# EAGLE design [COMPLETE] ArduinoShield_8x8DM (EAGLE 7.2.0)
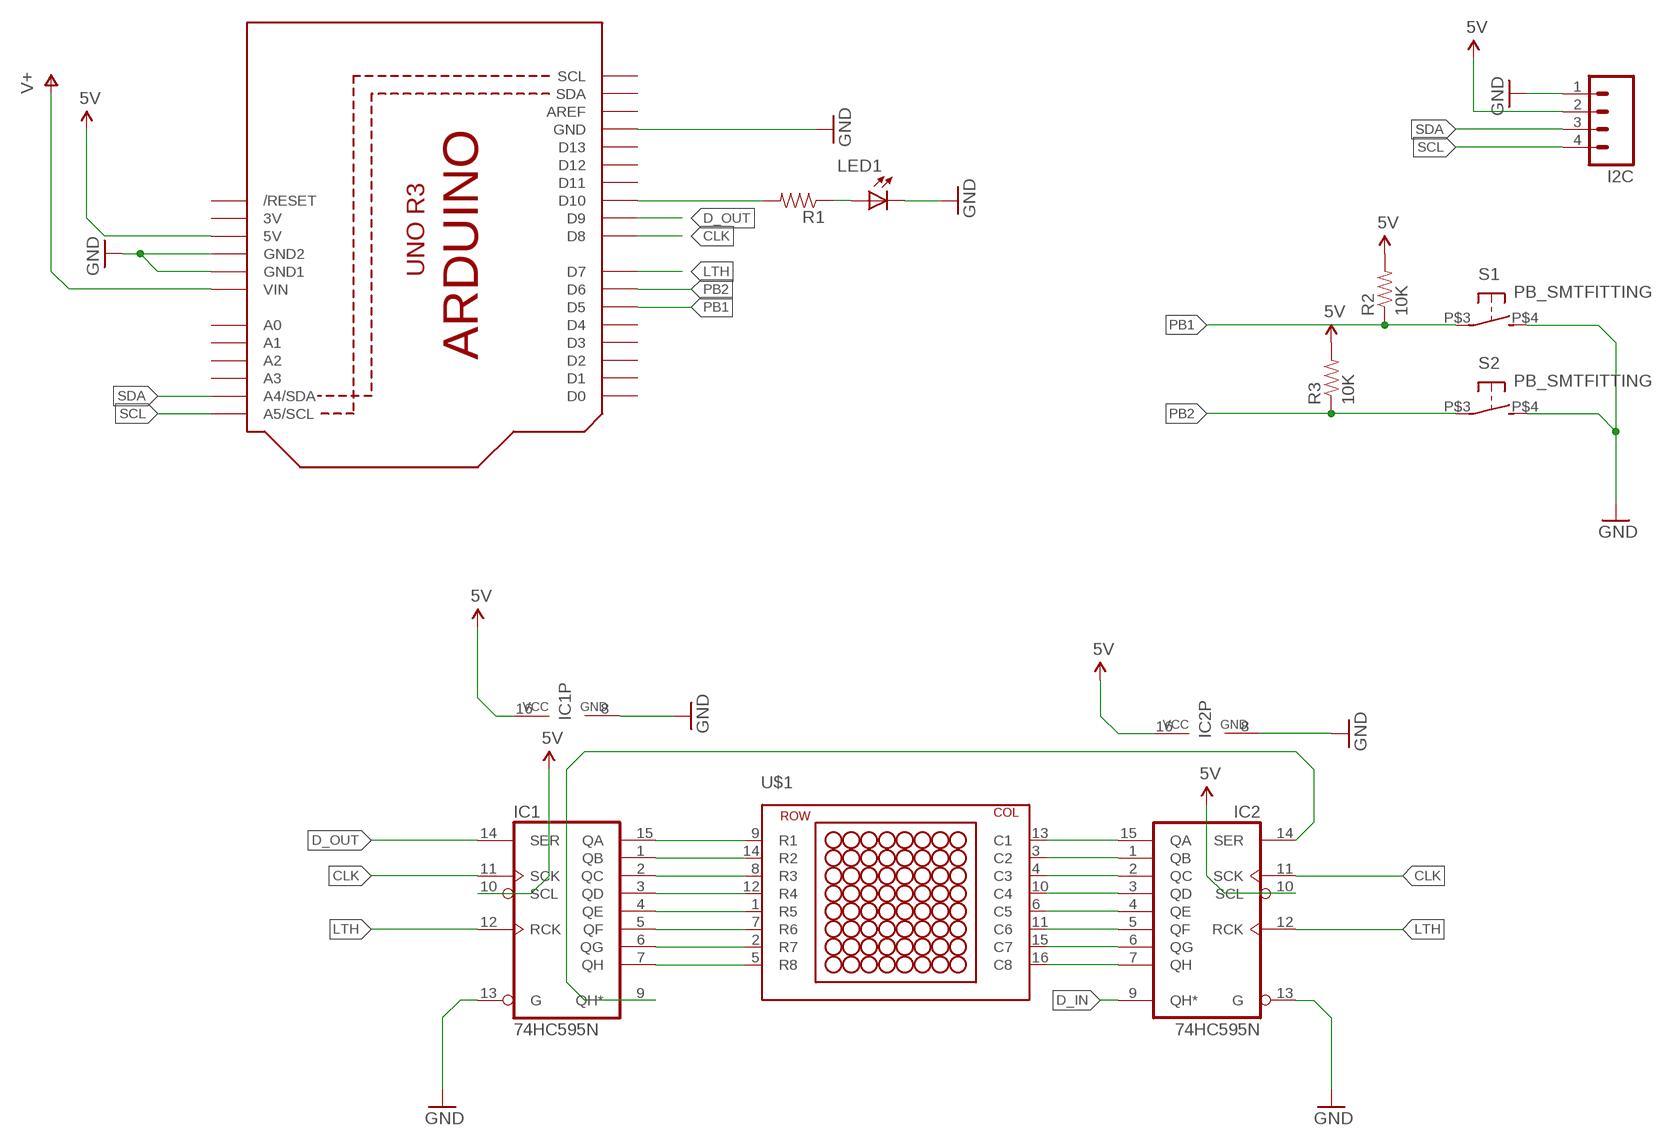
[diagram p0: schematic, sheet 1]

## Parts
I2C  M04PTH  [1X04]
IC1  74HC595N  [DIL16]
IC2  74HC595N  [DIL16]
LED1  LED/0805  [CHIP-LED0805]
R1  RESISTOR0805-RES  [0805]
R2  10K  RESISTOR0805-RES  [0805]
R3  10K  RESISTOR0805-RES  [0805]
S1  PB_SMTFITTING  [PB_SMT_TIGHT]
S2  PB_SMTFITTING  [PB_SMT_TIGHT]
U1  ARDUINOR3-NOIOREF-NOTEXT  [ARDUINOR3-NOTEXT-NOIOREF]
U$1  8X8DM_2088AS  [8X8DM_2088AS]

## Nets
5V: I2C.2 IC1.10(SCL) IC1.16(VCC) IC2.10(SCL) IC2.16(VCC) R2.2 R3.2 U1.5V
CLK: IC1.11(SCK) IC2.11(SCK) U1.D8
D_IN: IC2.9(QH*)
D_OUT: IC1.14(SER) U1.D9
GND: I2C.1 IC1.8(GND) IC1.13(G) IC2.8(GND) IC2.13(G) LED1.C S1.P$4 S2.P$4 U1.GND U1.GND1 U1.GND2
LTH: IC1.12(RCK) IC2.12(RCK) U1.D7
N$1: IC1.1(QB) U$1.14(R2)
N$5: IC1.2(QC) U$1.8(R3)
N$6: IC1.3(QD) U$1.12(R4)
N$7: IC1.4(QE) U$1.1(R5)
N$8: IC1.5(QF) U$1.7(R6)
N$9: IC1.6(QG) U$1.2(R7)
N$10: IC1.7(QH) U$1.5(R8)
N$11: IC1.15(QA) U$1.9(R1)
N$12: IC2.1(QB) U$1.3(C2)
N$13: IC2.2(QC) U$1.4(C3)
N$14: IC2.3(QD) U$1.10(C4)
N$15: IC2.4(QE) U$1.6(C5)
N$16: IC2.5(QF) U$1.11(C6)
N$17: IC2.6(QG) U$1.15(C7)
N$18: IC2.7(QH) U$1.16(C8)
N$19: IC2.15(QA) U$1.13(C1)
N$20: IC1.9(QH*) IC2.14(SER)
N$26: R1.2 U1.D10
N$30: LED1.A R1.1
PB1: R2.1 S1.P$3 U1.D5
PB2: R3.1 S2.P$3 U1.D6
SCL: I2C.4 U1.A5(A5/SCL)
SDA: I2C.3 U1.A4(A4/SDA)
V+: U1.VIN
Unconnected: U1.A0 U1.A1 U1.A2 U1.A3 U1.AREF U1.D0 U1.D1 U1.D2 U1.D3 U1.D4 U1.D11 U1.D12 U1.D13 U1.RESET(/RESET) U1.SCL U1.SDA

## Power pins joined to a net without a drawn wire
3V: U1.3V

## Library data of the parts
I2C = AISCube_BYOG:M04: Header 4 Standard 4-pin 0.1" header. Use with straight break away headers (SKU : PRT-00116), right angle break away headers (PRT-00553), swiss pins (PRT-00743), machine pins (PRT-00117), and female headers (PRT-00115). Molex polarized connector foot print use with SKU : PRT-08231 with associated crimp pins and housings. 1MM SMD Version SKU: PRT-10208
IC1 IC2 = 74xx-eu:74*595: 8-bit SHIFT REGISTER, output latch
LED1 = AISCube_BYOG:LED: LED
R1-R3 = AISCube_BYOG:RESISTOR: Resistor Basic schematic elements and footprints for 0603, 1206, and PTH resistors.
S1 S2 = AISCube:PB_SMT: Low profile SMT pushbutton Used as reset & user buttons
U1 = adafruit:ARDUINOR3-NOIOREF
U$1 = AISCube_BYOG:8X8DM_2088AS

## Board
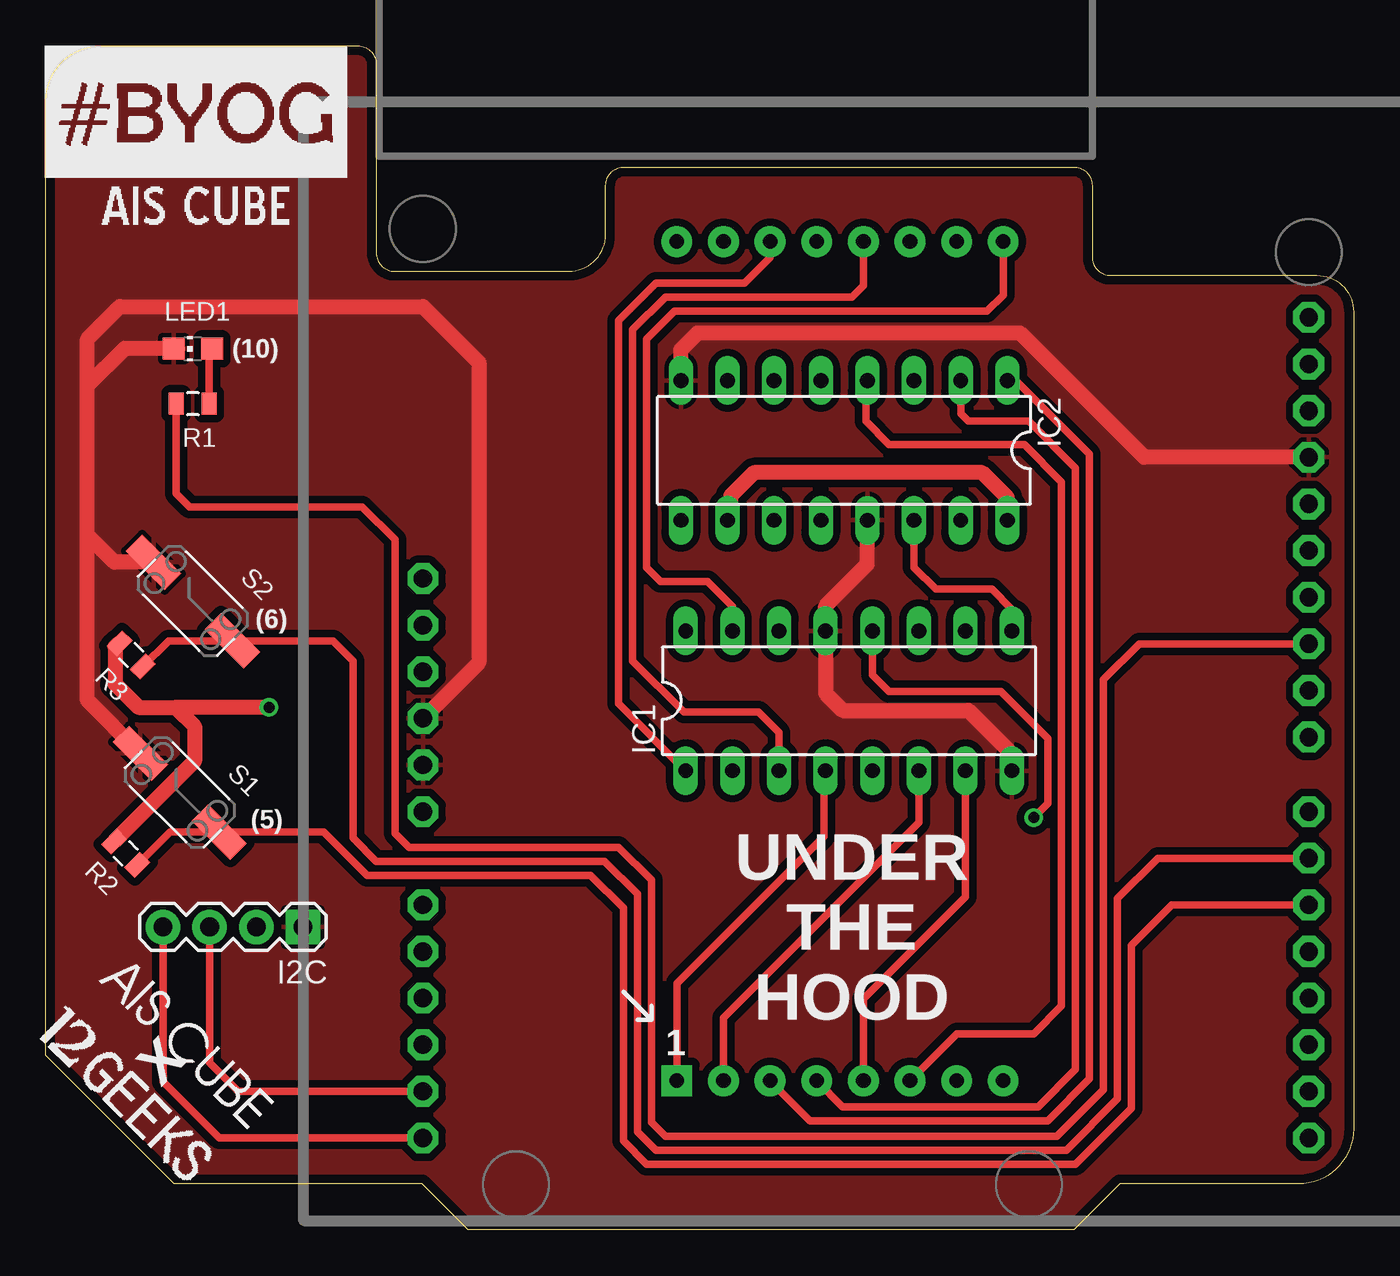
[diagram p1: board, top side]
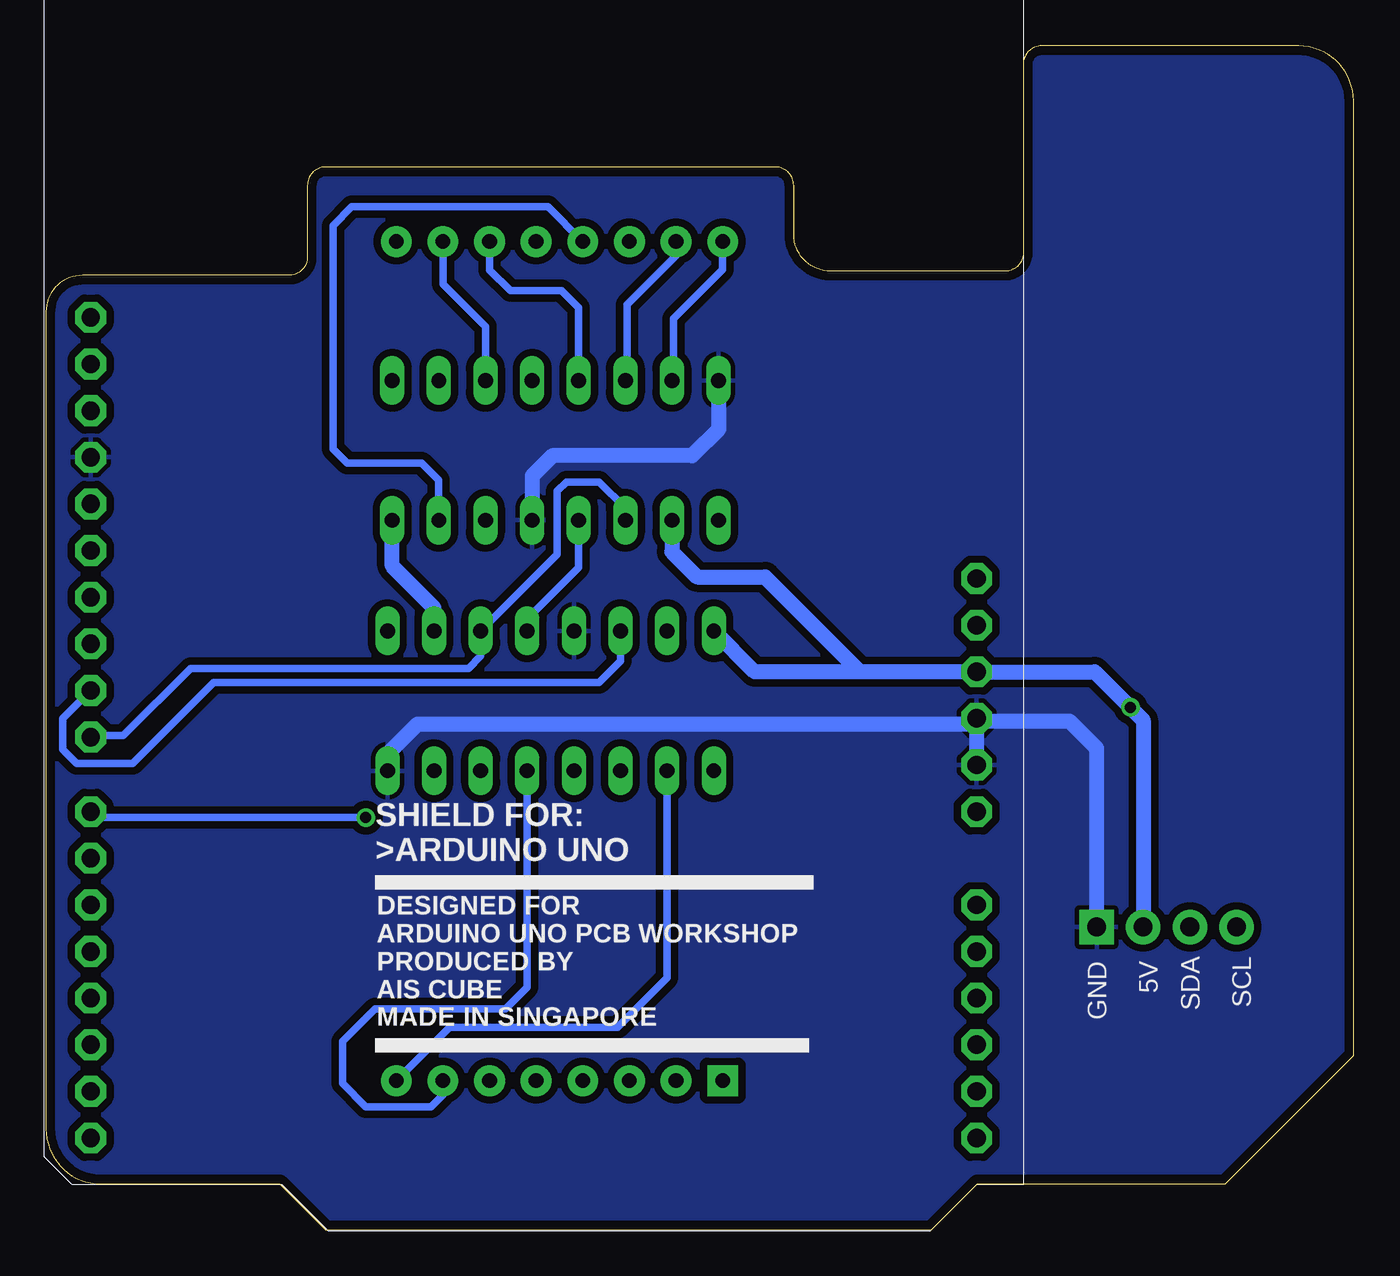
[diagram p2: board, bottom side, seen from below]

Size 71.25 x 64.5 mm. Coordinates in mm from the lower left corner, seen from the top.
Outline: 0,9.5 0,61.5 arc-90 3,64.5 17,64.5 arc-90 18,63.5 18,53.22 arc90 19,52.22 28.5,52.22 arc90 30.5,54.22 30.5,56.9 arc-90 31.5,57.9 56,57.9 arc-90 57,56.9 57,53 arc90 58,52 69.25,52 arc-90 71.25,50 71.25,5.5 arc-90 68.25,2.5 58.5,2.5 56,0 23,0 20.5,2.5 7,2.5 0,9.5
Copper layers (1*16): Top 0.0356mm / dielectric 1.5011mm / Bottom 0.0356mm
Design rules "AISCube": minimum track width 7mil, minimum drill 14mil, track to track 7mil, track to pad 7mil, pad to pad 7mil, via to via 7mil, smd to smd 0mil, copper to edge 20mil, drill to drill 8mil, minimum pad ring 10mil, minimum via ring 8mil, stop-mask expansion 4mil, vias tented up to drill 32mil, thermal gap 10mil

### Footprints (pad centres in the part's own frame; a part is rotated, then mirrored left to right if it is on the bottom)
1X04 = drill 1.016 pad 1.88 square: 1 0,0 | drill 1.016 pad 1.88: 2 2.54,0; 3 5.08,0; 4 7.62,0
DIL16 = drill 0.813 long: 1 -8.89,-3.81; 2 -6.35,-3.81; 3 -3.81,-3.81; 4 -1.27,-3.81; 5 1.27,-3.81; 6 3.81,-3.81; 7 6.35,-3.81; 8 8.89,-3.81; 9 8.89,3.81; 10 6.35,3.81; 11 3.81,3.81; 12 1.27,3.81; 13 -1.27,3.81; 14 -3.81,3.81; 15 -6.35,3.81; 16 -8.89,3.81
CHIP-LED0805 = smd 1.2 x 1.2: A 0,-1.05; C 0,1.05
0805 = smd 0.8 x 1.2: 1 -0.9,0; 2 0.9,0
PB_SMT_TIGHT = smd 3 x 1.27: P$3 -3.056,0.008; P$4 3.01,0.008
ARDUINOR3-NOTEXT-NOIOREF = drill 1 pad 1.676 octagon: 3V 35.56,2.54; 5V 38.1,2.54; A0 50.8,2.54; A1 53.34,2.54; A2 55.88,2.54; A3 58.42,2.54; A4 60.96,2.54; A5 63.5,2.54; AREF 23.876,50.8; D0 63.5,50.8; D1 60.96,50.8; D2 58.42,50.8; D3 55.88,50.8; D4 53.34,50.8; D5 50.8,50.8; D6 48.26,50.8; D7 45.72,50.8; D8 41.656,50.8; D9 39.116,50.8; D10 36.576,50.8; D11 34.036,50.8; D12 31.496,50.8; D13 28.956,50.8; GND 26.416,50.8; GND1 43.18,2.54; GND2 40.64,2.54; RESET 33.02,2.54; SCL 18.796,50.8; SDA 21.336,50.8; VIN 45.72,2.54
8X8DM_2088AS = drill 0.8 pad 1.676 square: 1 -8.89,0 | drill 0.8 pad 1.676: 2 -6.35,0; 3 -3.81,0; 4 -1.27,0; 5 1.27,0; 6 3.81,0; 7 6.35,0; 8 8.89,0; 9 8.89,45.72; 10 6.35,45.72; 11 3.81,45.72; 12 1.27,45.72; 13 -1.27,45.72; 14 -3.81,45.72; 15 -6.35,45.72; 16 -8.89,45.72

### Placement (x,y rotation side)
I2C  14,16.5 180 top
IC1  43.75,28.82 0 top
IC2  43.49,42.46 180 top
LED1  8,48 90 top
R1  8,45 180 top
R2  4.35,20.51 135 top
R3  4.65,31.31 135 top
S1  7.28,23.83 135 top
S2  8,34.25 135 top
U1  18,68.5 270 top
U$1  43.27,8.12 0 top
U$2  [LOGO_17MM]  -0.02,54.74 0 top
U$8  [LOGO_12GEEKS]  -1.65,10.51 315 top
U$9  [AISCUBE_LOGO_S]  2.88,13.53 315 top

### Tracks (layer width: path | path; a pad name or v marks a point on that pad's centre or on a via)
5V  (via drill 0.6)
  Top 0.813: IC2.16 52.38,39.89 51.02,41.25 38.57,41.25 37.3,39.98 37.3,38.82 IC2.10 | R3.2 3.97,31.95 3.78,31.76 3.78,29.73 5.05,28.46 7.08,28.46 | 7.08,28.46 8.09,27.44 8.09,25.53 R2.2 | v12.16,28.46 7.08,28.46
  Bottom 0.813: I2C.2 11.46,27.76 v12.16,28.46 14.1,30.4 U1.5V 26.89,30.4 | 26.89,30.4 32.63,30.4 IC1.16 | IC2.10 37.14,36.93 35.78,35.57 32.06,35.57 26.89,30.4 | IC1.10 50.1,33.89 52.38,36.16 IC2.16
CLK
  Bottom 0.406: U1.D8 68.71,26.93 67.02,26.93 63.37,30.58 48.23,30.58 47.56,31.25 IC1.11 43.4,36.79 43.4,40.24 42.89,40.74 41.11,40.74 39.68,39.31 IC2.11
D_OUT
  Bottom 0.406: IC1.14 39.94,31 41.11,29.82 62.1,29.82 66.51,25.41 69.56,25.41 70.32,26.17 70.32,27.86 U1.D9
GND
  Top 0.813: IC1.8 52.64,25.92 50.26,28.3 43.4,28.3 42.48,29.22 IC1.13 42.48,33.98 44.76,36.26 IC2.13 | IC2.8 34.6,47.94 35.53,48.87 53.05,48.87 59.84,42.08 U1.GND | S1.P$4 2.25,28.85 2.25,37.85 | 2.25,37.85 2.25,45.98 | 2.25,45.98 2.25,48.52 4.03,50.3 20.54,50.3 23.59,47.25 23.59,30.91 U1.GND2 | LED1.C 6.94,48.01 4.28,48.01 2.25,45.98 | S2.P$4 3.73,36.38 2.25,37.85
  Bottom 0.813: U1.GND2 U1.GND1 | IC1.8 52.64,25.92 51.02,27.54 20.86,27.54 U1.GND2 | IC2.8 34.6,43.61 36.03,42.17 43.65,42.17 44.76,41.07 IC2.13 | 20.45,27.95 U1.GND2 | I2C.1 14,26.23 15.46,27.69 20.37,27.69 U1.GND2
  pour Top (isolate 0.406): 0,9.5 0,62.5 2,64.5 17,64.5 18,63.5 18,53.5 19,52.5 29,52.5 30,53.5 30,57.5 31,58.5 56,58.5 57,57.5 57,53.5 58,52.5 70,52.5 71,51.5 71,3.5 70,2.5 59,2.5 56,-0.5 23,-0.5 20,2.5 7,2.5
  pour Bottom (isolate 0.406): 0,62.5 2,64.5 17,64.5 18,63.5 18,53.5 19,52.5 29,52.5 30,53.5 30,57.5 31,58.5 56,58.5 57,57.5 57,53.5 58,52.5 70,52.5 71,51.5 71,3.5 70,2.5 59,2.5 56,-0.5 23,-0.5 20,2.5 7,2.5 0,9.5
LTH  (via drill 0.6)
  Top 0.406: IC1.12 45.02,30.23 45.94,29.31 52.04,29.31 54.58,26.77 54.58,23.22 v53.81,22.46
  Bottom 0.406: IC2.12 42.22,36.08 45.02,33.28 IC1.12 | v53.81,22.46 68.48,22.46 U1.D7
N$1
  Top 0.406: IC1.1 31.21,28.66 31.21,49.54 33.24,51.57 38.07,51.57 39.46,52.96 U$1.14
N$5
  Bottom 0.406: IC1.2 37.4,13.72 40.1,11.03 49.25,11.03 U$1.8
N$6
  Top 0.406: U$1.12 44.54,51.44 43.91,50.81 33.75,50.81 31.97,49.03 31.97,31 34.76,28.2 38.83,28.2 39.94,27.09 IC1.3
N$7
  Top 0.406: U$1.1 34.38,13.43 42.38,21.44 42.38,24.91 IC1.4
N$8
  Bottom 0.406: IC1.5 45.02,13.22 46.19,12.04 53.31,12.04 55.08,10.26 55.08,7.98 53.81,6.71 50.26,6.71 49.62,7.35 U$1.7
N$9
  Top 0.406: U$1.2 36.92,11.56 47.56,22.2 IC1.6
N$10
  Top 0.406: U$1.5 44.54,12.57 50.1,18.14 IC1.7
N$11
  Top 0.406: IC1.15 37.4,33.95 36.03,35.31 33.49,35.31 32.73,36.08 32.73,48.52 34.26,50.05 51.27,50.05 52.16,50.93 U$1.9
N$12
  Top 0.406: IC2.1 52.86,46.27 56.86,42.27 56.86,8.23 54.58,5.95 41.63,5.95 U$1.3
N$13
  Top 0.406: IC2.2 49.84,44.47 50.26,44.05 53.56,44.05 56.1,41.51 56.1,8.74 54.07,6.71 43.41,6.71 U$1.4
N$14
  Bottom 0.406: IC2.3 47.3,49.21 49.62,51.53 U$1.10
N$15
  Top 0.406: IC2.4 44.67,46.19 44.67,44.05 45.94,42.78 53.31,42.78 55.34,40.74 55.34,12.2 53.81,10.68 49.63,10.68 U$1.6
N$16
  Bottom 0.406: IC2.5 42.22,50.23 43.15,51.16 45.94,51.16 47.08,52.29 U$1.11
N$17
  Bottom 0.406: U$1.15 36.92,53.07 39.59,50.4 39.59,46.36 IC2.6
N$18
  Bottom 0.406: U$1.16 34.38,52.31 37.05,49.63 37.05,46.36 IC2.7
N$19
  Bottom 0.406: IC2.15 49.84,40.83 50.77,41.76 54.83,41.76 55.59,42.52 55.59,54.71 54.58,55.73 43.89,55.73 U$1.13
N$20
  Top 0.406: IC2.14 47.3,36.08 48.48,34.9 51.53,34.9 52.64,33.79 IC1.9
N$26
  Top 0.406: R1.2 7.1,40.12 7.84,39.38 17.24,39.38 19.02,37.6 19.02,21.6 19.78,20.84 31.21,20.84 32.99,19.06 32.99,5.85 33.75,5.09 55.08,5.09 57.62,7.63 57.62,29.98 59.57,31.92 U1.D10
N$30
  Top 0.406: R1.1 8.9,47.85 LED1.A
PB1
  Top 0.406: R2.1 6.77,21.66 S1.P$3 15.14,21.66 17.49,19.31 29.68,19.31 31.46,17.53 31.46,4.83 32.73,3.56 56.1,3.56 59.15,6.61 59.15,15.5 61.35,17.7 U1.D5
PB2
  Top 0.406: R3.1 6.69,32.09 S2.P$3 15.64,32.09 16.73,31 16.73,21.34 18,20.07 30.45,20.07 32.22,18.3 32.22,5.34 33.24,4.33 55.59,4.33 58.39,7.12 58.39,18.04 60.58,20.24 U1.D6
SCL
  Top 0.406: U1.A5 9.45,5 6.38,8.07 I2C.4
SDA
  Top 0.406: U1.A4 10.47,7.54 8.92,9.09 I2C.3

### Text on the board
tPlace: (10) | (6) | (5) | UNDER / THE / HOOD | 1 | X
bPlace: SHIELD FOR: / >ARDUINO UNO | SCL | SDA | 5V | GND | DESIGNED FOR / ARDUINO UNO PCB WORKSHOP / PRODUCED BY / AIS CUBE | MADE IN SINGAPORE